# EAGLE design TSAL Proto18 (EAGLE 6.5.0)
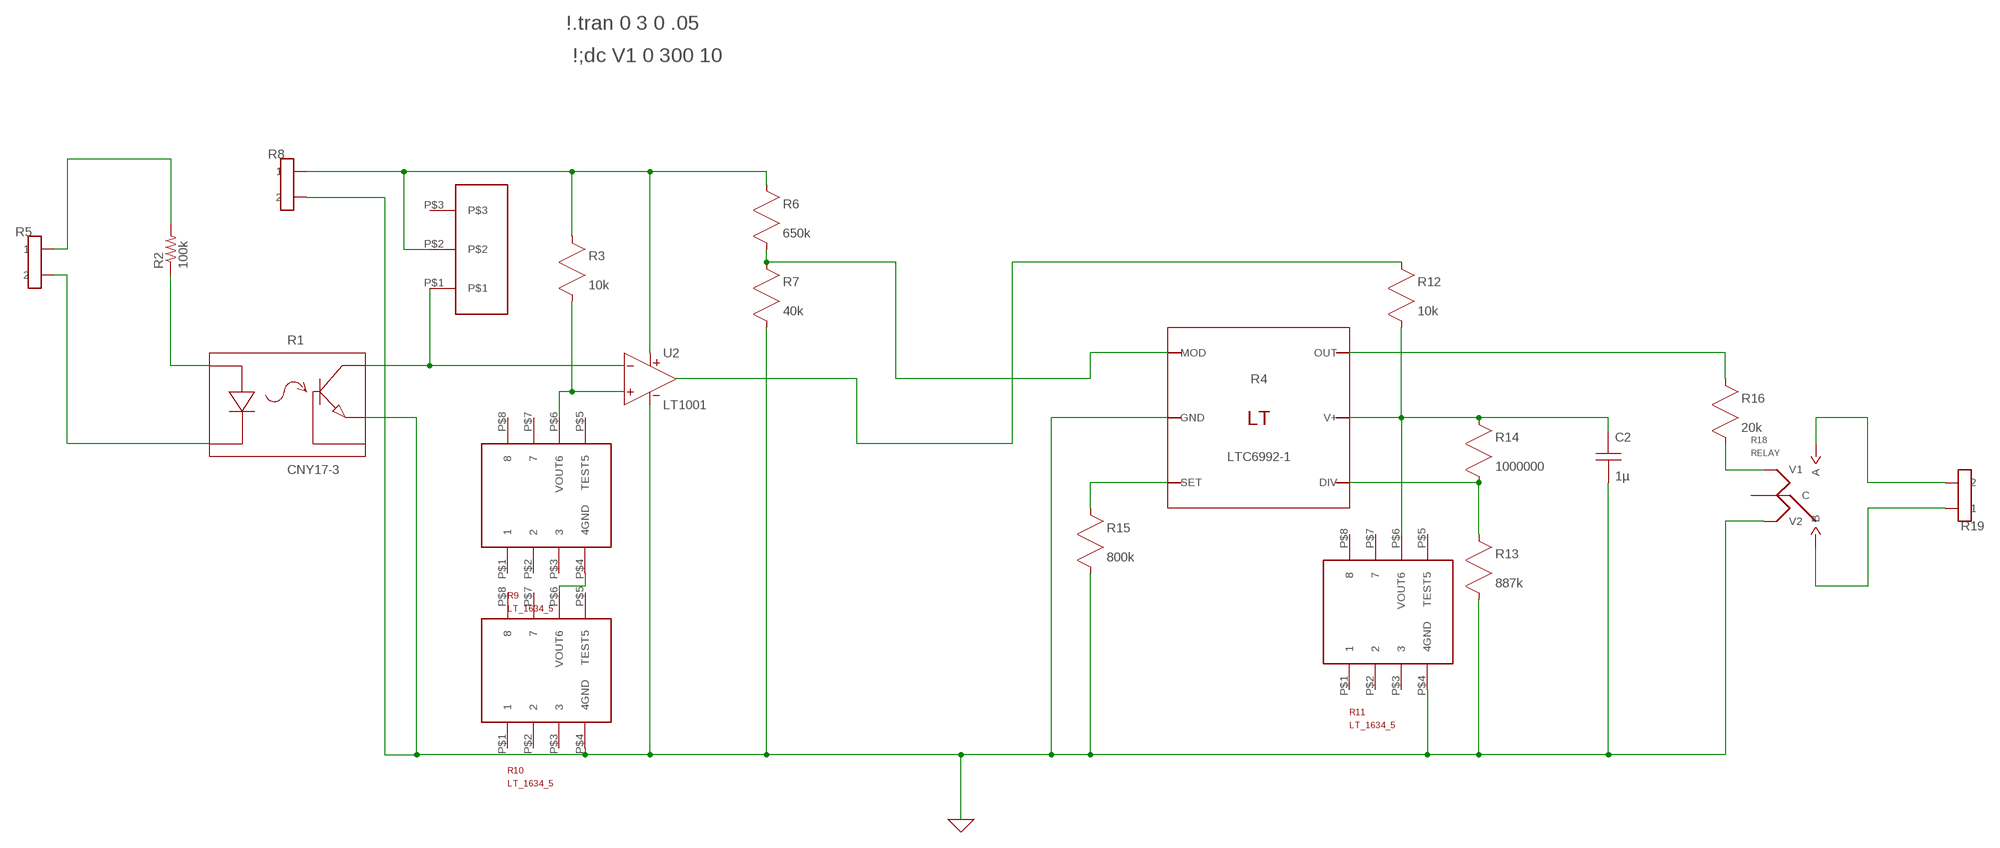
[diagram p0: schematic, sheet 1]

## Parts
C2  1µ  CAP  [C0805]
R1  CNY17-3  [CNY17-3]
R2  100k  R-US_0817/22  [P0817/22]
R3  10k  RES  [R0805]
R4  LTC6992-1  [LTC6992-1]
R5  CONN_2  [CONNECTOR_2]
R6  650k  RES  [R0805]
R7  40k  RES  [R0805]
R8  CONN_2  [CONNECTOR_2]
R9  LT_1634_5MS8  [LT_1634_5]
R10  LT_1634_5MS8  [LT_1634_5]
R11  LT_1634_5MS8  [LT_1634_5]
R12  10k  RES  [R0805]
R13  887k  RES  [R0805]
R14  1000000  RES  [R0805]
R15  800k  RES  [R0805]
R16  20k  RES  [R0805]
R17  RK097111T  [RK097111T]
R18  RELAY  [RELAY]
R19  CONN_2  [CONNECTOR_2]
U2  LT1001  [S8]

## Nets
0: C2.2(B) R1.P$4(E) R4.P$2(GND) R7.2(B) R8.3 R8.4 R10.P$4(4GND) R11.P$4(4GND) R13.2(B) R15.2(B) R18.V2 U2.4(V-)
N$1: R2.2 R5.1 R5.2
N$2: R1.P$2(K) R5.3 R5.4
N$3: R9.P$4(4GND) R10.P$6(VOUT6)
N$4: R3.1(A) R6.1(A) R8.1 R8.2 R17.P$2 U2.8(V+)
N$5: R16.2(B) R18.V1
N$6: R12.1(A) U2.3(OUT)
N$7: R4.P$1(MOD) R6.2(B) R7.1(A)
N$8: R4.P$6(OUT) R16.1(A)
N$9: R1.P$1(A) R2.1
N$10: R1.P$5(C) R17.P$1 U2.2(IN-)
N$11: R18.A R19.3 R19.4
N$12: R3.2(B) R9.P$6(VOUT6) U2.1(IN+)
N$13: R18.B R19.1 R19.2
N$15: C2.1(A) R4.P$5(V+) R11.P$6(VOUT6) R12.2(B) R14.1(A)
N$18: R4.P$3(SET) R15.1(A)
N$19: R4.P$4(DIV) R13.1(A) R14.2(B)
Unconnected: R1.P$6(B) R9.P$1 R9.P$2 R9.P$3 R9.P$5(TEST5) R9.P$7 R9.P$8 R10.P$1 R10.P$2 R10.P$3 R10.P$5(TEST5) R10.P$7 R10.P$8 R11.P$1 R11.P$2 R11.P$3 R11.P$5(TEST5) R11.P$7 R11.P$8 R17.P$3 R18.CENTER(C)

## Notes on the sheet
- \!.tran 0 3 0 .05
- \!;dc V1 0 300 10

## Library data of the parts
C2 = sym:CAP: Capacitor
R1 = FE_Kenny:CNY17-3
R2 = resistor:R-US_: RESISTOR, American symbol
R3 R6 R7 R12-R16 = sym:RES: A resistor
R4 = FE_Kenny:LTC6992-1
R5 R8 R19 = formula electric:CONN_2
R9-R11 = FE_Kenny:LT_1634_5
R17 = FE_Kenny:RK097111T
R18 = formula electric:RELAY
U2 = Opamps:LT1001: Precision Operational Amplifier

## Board
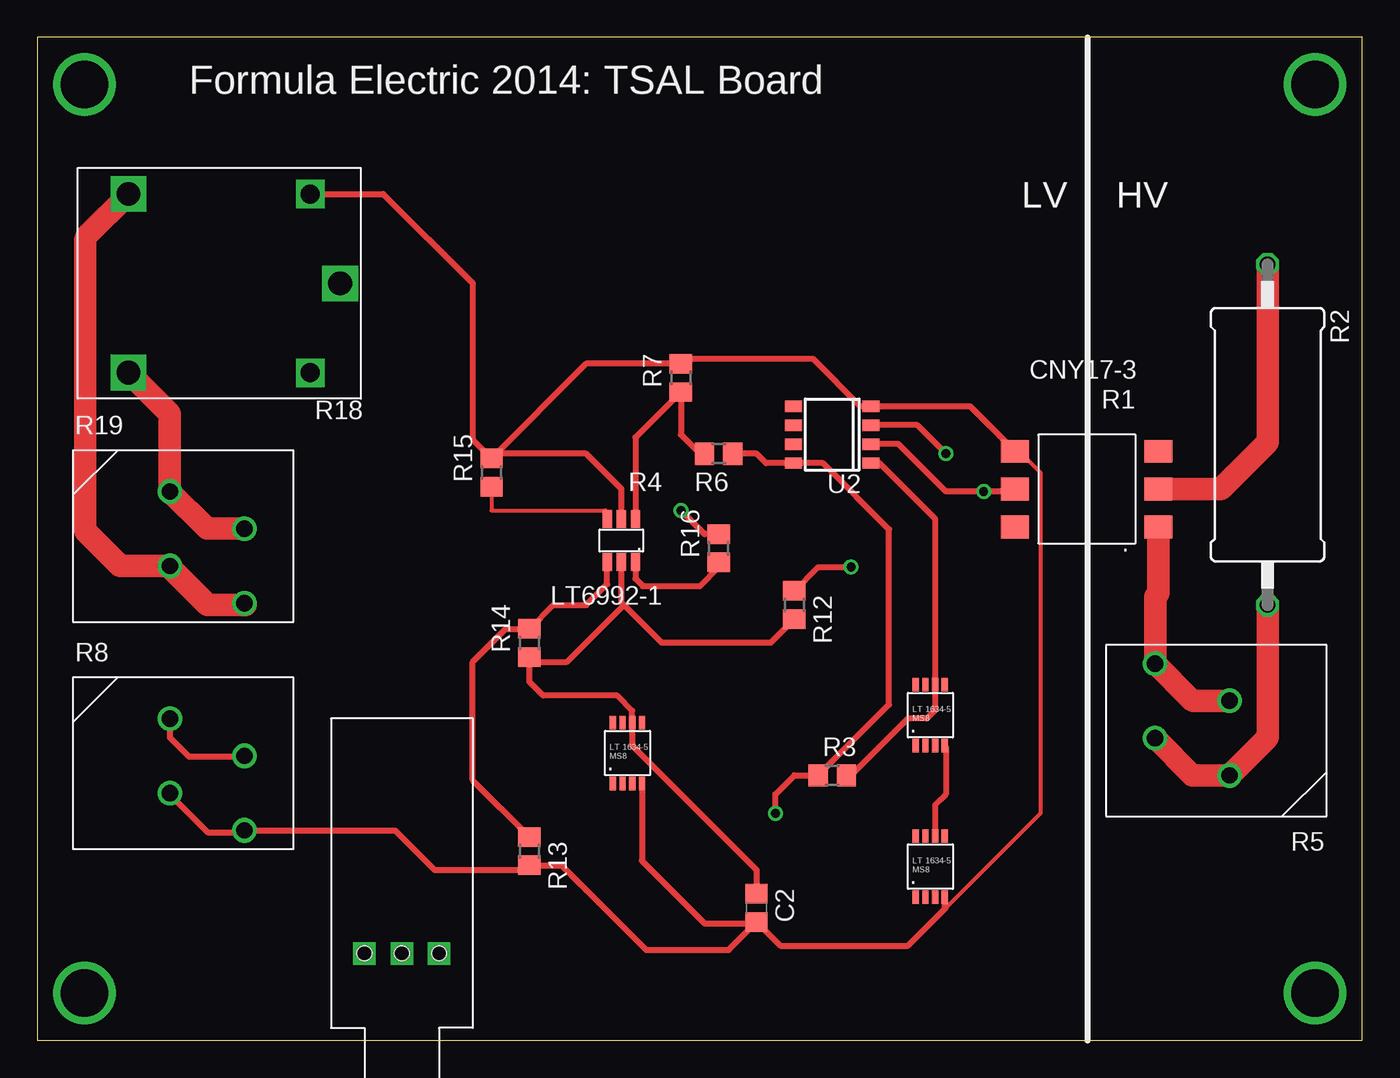
[diagram p1: board, top side]
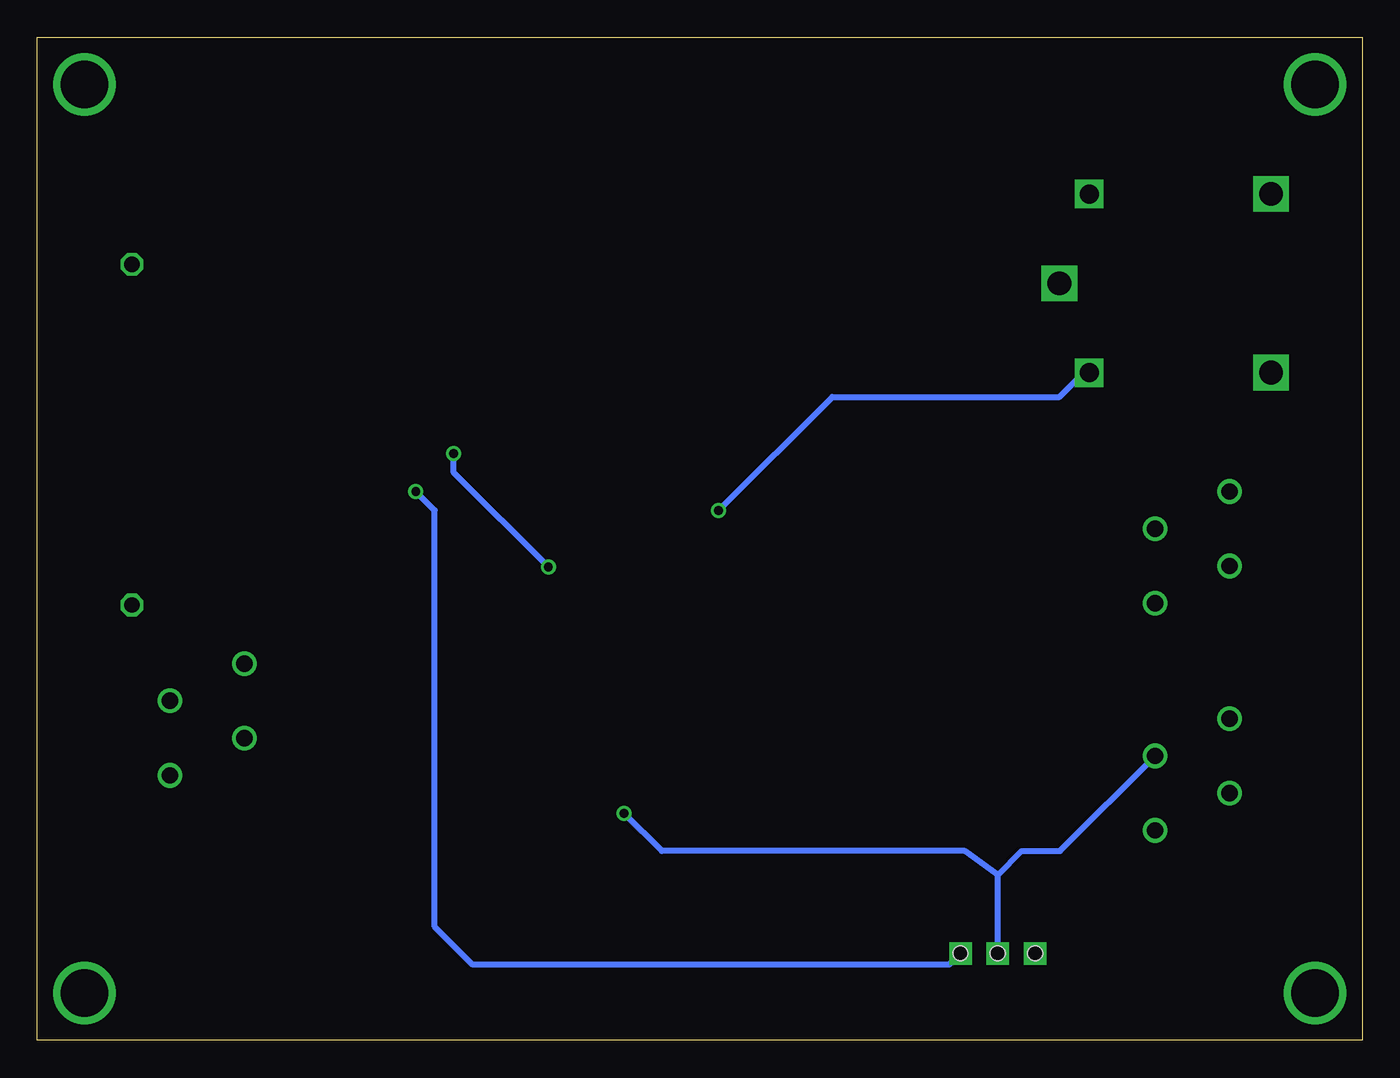
[diagram p2: board, bottom side, seen from below]

Size 88.9 x 67.31 mm. Coordinates in mm from the lower left corner, seen from the top.
Outline: 0,0 88.9,0 88.9,67.31 0,67.31 0,0
Copper layers (1*16): Top 0.035mm / dielectric 1.5mm / Bottom 0.035mm
Design rules "default": minimum track width 10mil, minimum drill 24mil, track to track 8mil, track to pad 8mil, pad to pad 8mil, via to via 8mil, smd to smd 8mil, copper to edge 40mil, drill to drill 8mil, minimum pad ring 10mil, minimum via ring 8mil, stop-mask expansion 4mil, vias tented up to drill 0mil, thermal gap 10mil

### Footprints (pad centres in the part's own frame; a part is rotated, then mirrored left to right if it is on the bottom)
C0805 = smd 1.3 x 1.5: 1 -0.95,0; 2 0.95,0
CNY17-3 = smd 1.88 x 1.52: P$1 -1.55,3.65; P$2 -1.55,6.19; P$3 -1.55,1.11; P$4 8.05,1.11; P$5 8.05,3.65; P$6 8.05,6.19
P0817/22 = drill 1.016 octagon: 1 -11.43,0; 2 11.43,0
R0805 = smd 1.3 x 1.5: 1 -0.95,0; 2 0.95,0
LTC6992-1 = smd 0.62 x 1.22: P$1 0.5,-0.7; P$2 1.45,-0.7; P$3 2.4,-0.7; P$4 2.4,2.2; P$5 1.45,2.2; P$6 0.5,2.2
CONNECTOR_2 = drill 1.1: 1 0,0; 2 2.5,5; 3 5,0; 4 7.5,5
LT_1634_5 = smd 0.42 x 0.9: P$1 0.52,-0.55; P$2 1.17,-0.55; P$3 1.82,-0.55; P$4 2.47,-0.55; P$5 2.47,3.55; P$6 1.82,3.55; P$7 1.17,3.55; P$8 0.52,3.55
RK097111T = drill 1 square: P$1 2.25,15.75; P$2 4.75,15.75; P$3 7.25,15.75 | hole 1: 4.75,15.75; 7.25,15.75; 2.25,15.75
RELAY = drill 1.6 square: A 14.199,-5.994; B 14.199,5.994; CENTER 0,0 | drill 1.27 square: V1 2.007,5.994; V2 2.007,-5.994
S8 = smd 0.762 x 1.143: 1 -1.905,-2.6; 2 -0.635,-2.6; 3 0.635,-2.6; 4 1.905,-2.6; 5 1.905,2.6; 6 0.635,2.6; 7 -0.635,2.6; 8 -1.905,2.6

### Placement (x,y rotation side)
C2  48.26,8.89 270 top
R1  73.66,40.64 180 top
R2  82.55,40.64 270 top
R3  53.34,17.78 0 top
R4  40.64,34.29 180 top
R5  80.01,17.78 90 top
R6  45.72,39.37 180 top
R7  43.18,44.45 90 top
R8  8.89,21.59 270 top
R9  58.42,20.32 0 top
R10  58.42,10.16 0 top
R11  38.1,17.78 0 top
R12  50.8,29.21 270 top
R13  33.02,12.7 270 top
R14  33.02,26.67 90 top
R15  30.48,38.1 90 top
R16  45.72,33.02 90 top
R17  29.21,21.59 180 top
R18  20.32,50.8 180 top
R19  8.89,36.83 270 top
U2  53.34,40.64 90 top

### Tracks (layer width: path | path; a pad name or v marks a point on that pad's centre or on a via)
0
  Top 0.254: 60.96,8.89 67.31,15.24 67.31,38.1 66.04,39.37 R1.P$4 | 43.18,45.72 R7.2
  Top 0.406: R8.3 8.89,16.51 11.43,13.97 13.77,13.97 R8.4 24.01,14.09 26.67,11.43 32.7,11.43 R13.2 | C2.2 49.85,6.35 58.42,6.35 60.96,8.89 60.89,8.96 R10.P$4 | R1.P$4 62.59,42.55 U2.4 55.24,42.55 52.07,45.72 43.5,45.72 R7.2 36.83,45.4 R15.2 | R18.V2 23.22,56.79 29.21,50.8 29.21,40.32 R15.2 | R4.P$2 39.19,37.01 36.83,39.37 30.8,39.37 R15.2 | 33.02,11.43 R13.2 | R13.2 35.18,11.75 40.86,6.07 46.39,6.07 C2.2 | R11.P$4 40.57,12.05 44.78,7.84 48.16,7.84 C2.2
N$1
  Top 1.52: R5.2 77.51,17.78 R5.1 82.55,20.32 R2.2
N$2
  Top 0.406: 77.55,22.78 77.47,22.86 77.43,22.86 | 75.21,30 75.18,29.97 75.01,29.8
  Top 1.52: R5.3 77.55,22.78 | 77.43,22.86 R5.4 75.01,29.8 | R1.P$2 75.21,30
N$3
  Top 0.406: R9.P$4 60.96,19.7 60.96,16.51 60.24,15.79 R10.P$6
N$4  (via drill 0.6)
  Top 0.406: R8.1 8.89,20.32 10.16,19.05 13.85,19.05 R8.2 | v49.53,15.24 49.53,16.51 50.8,17.78 R3.1 57.15,22.54 57.15,34.29 52.7,38.73 U2.8 48.9,38.73 48.26,39.37 R6.1
  Bottom 0.406: R17.P$2 24.46,11.1 | 24.46,11.1 22.86,12.7 20.28,12.7 R8.2 | 24.46,11.1 26.67,12.7 46.99,12.7 v49.53,15.24
N$5  (via drill 0.6)
  Top 0.406: R16.2 44.77,33.97 v43.18,35.56
  Bottom 0.406: v43.18,35.56 35.56,43.18 20.32,43.18 19.05,44.45 18.67,44.45 R18.V1
N$6  (via drill 0.6)
  Top 0.406: R12.1 52.39,31.75 v54.61,31.75 | v60.96,39.37 59.05,41.27 U2.3
  Bottom 0.406: v54.61,31.75 60.96,38.1 v60.96,39.37
N$7
  Top 0.406: R4.P$1 40.14,40.46 R7.1 43.18,40.64 44.45,39.37 R6.2
N$8
  Top 0.406: R4.P$6 40.14,30.98 40.64,30.48 44.45,30.48 45.72,31.75 R16.1
N$9
  Top 1.52: R1.P$1 79.41,36.99 82.55,40.13 R2.1
N$10  (via drill 0.6)
  Top 0.406: R1.P$5 65.45,36.83 v63.5,36.83 60.96,36.83 57.78,40.01 U2.2
  Bottom 0.406: R17.P$1 27.72,5.08 59.69,5.08 62.23,7.62 62.23,35.56 v63.5,36.83
N$11
  Top 0.406: R19.3 8.89,31.75 | 13.97,29.21 13.97,29.25 R19.4 | 3.21,53.73 3.33,53.84 3.33,54
  Top 1.52: 8.89,31.75 11.43,29.21 13.97,29.21 | R19.3 5.57,31.83 3.21,34.19 3.21,53.73 | 3.33,54 R18.A
N$12
  Top 0.406: U2.1 56.52,38.73 60.24,35.01 R9.P$6 60.24,22.14 59.69,21.59 58.42,21.59 54.61,17.78 R3.2
N$13
  Top 0.406: R18.B 6.14,44.81 | R19.1
  Top 1.52: R19.2 11.39,34.33 R19.1 | 6.14,44.81 8.89,42.05 R19.1
N$14  (via drill 3.17)
  other vias: 3.17,64.14
N$15
  Top 0.406: 39.37,29.21 35.56,25.4 33.34,25.4 R14.1 33.02,24.06 33.94,23.14 38.9,23.14 39.92,22.11 R11.P$6 39.92,19.77 48.26,11.43 C2.1 | 39.37,29.21 39.19,29.39 R4.P$5 | 39.37,29.21 41.91,26.67 49.21,26.67 R12.2
N$16  (via drill 3.17)
  other vias: 85.72,64.14
N$17  (via drill 3.17)
  other vias: 85.72,3.17
N$18
  Top 0.254: R15.1 30.48,35.56 38.1,35.56 R4.P$3
N$19
  Top 0.406: R13.1 29.21,17.46 29.21,25.4 31.43,27.62 R14.2 34.61,29.21 36.83,29.21 38.24,30.62 R4.P$4
N$20  (via drill 3.17)
  other vias: 3.17,3.17

### Text on the board
tNames: Formula Electric 2014: TSAL Board | LV | HV